# EAGLE schematic zegarek_v1.4 (EAGLE 6.2)
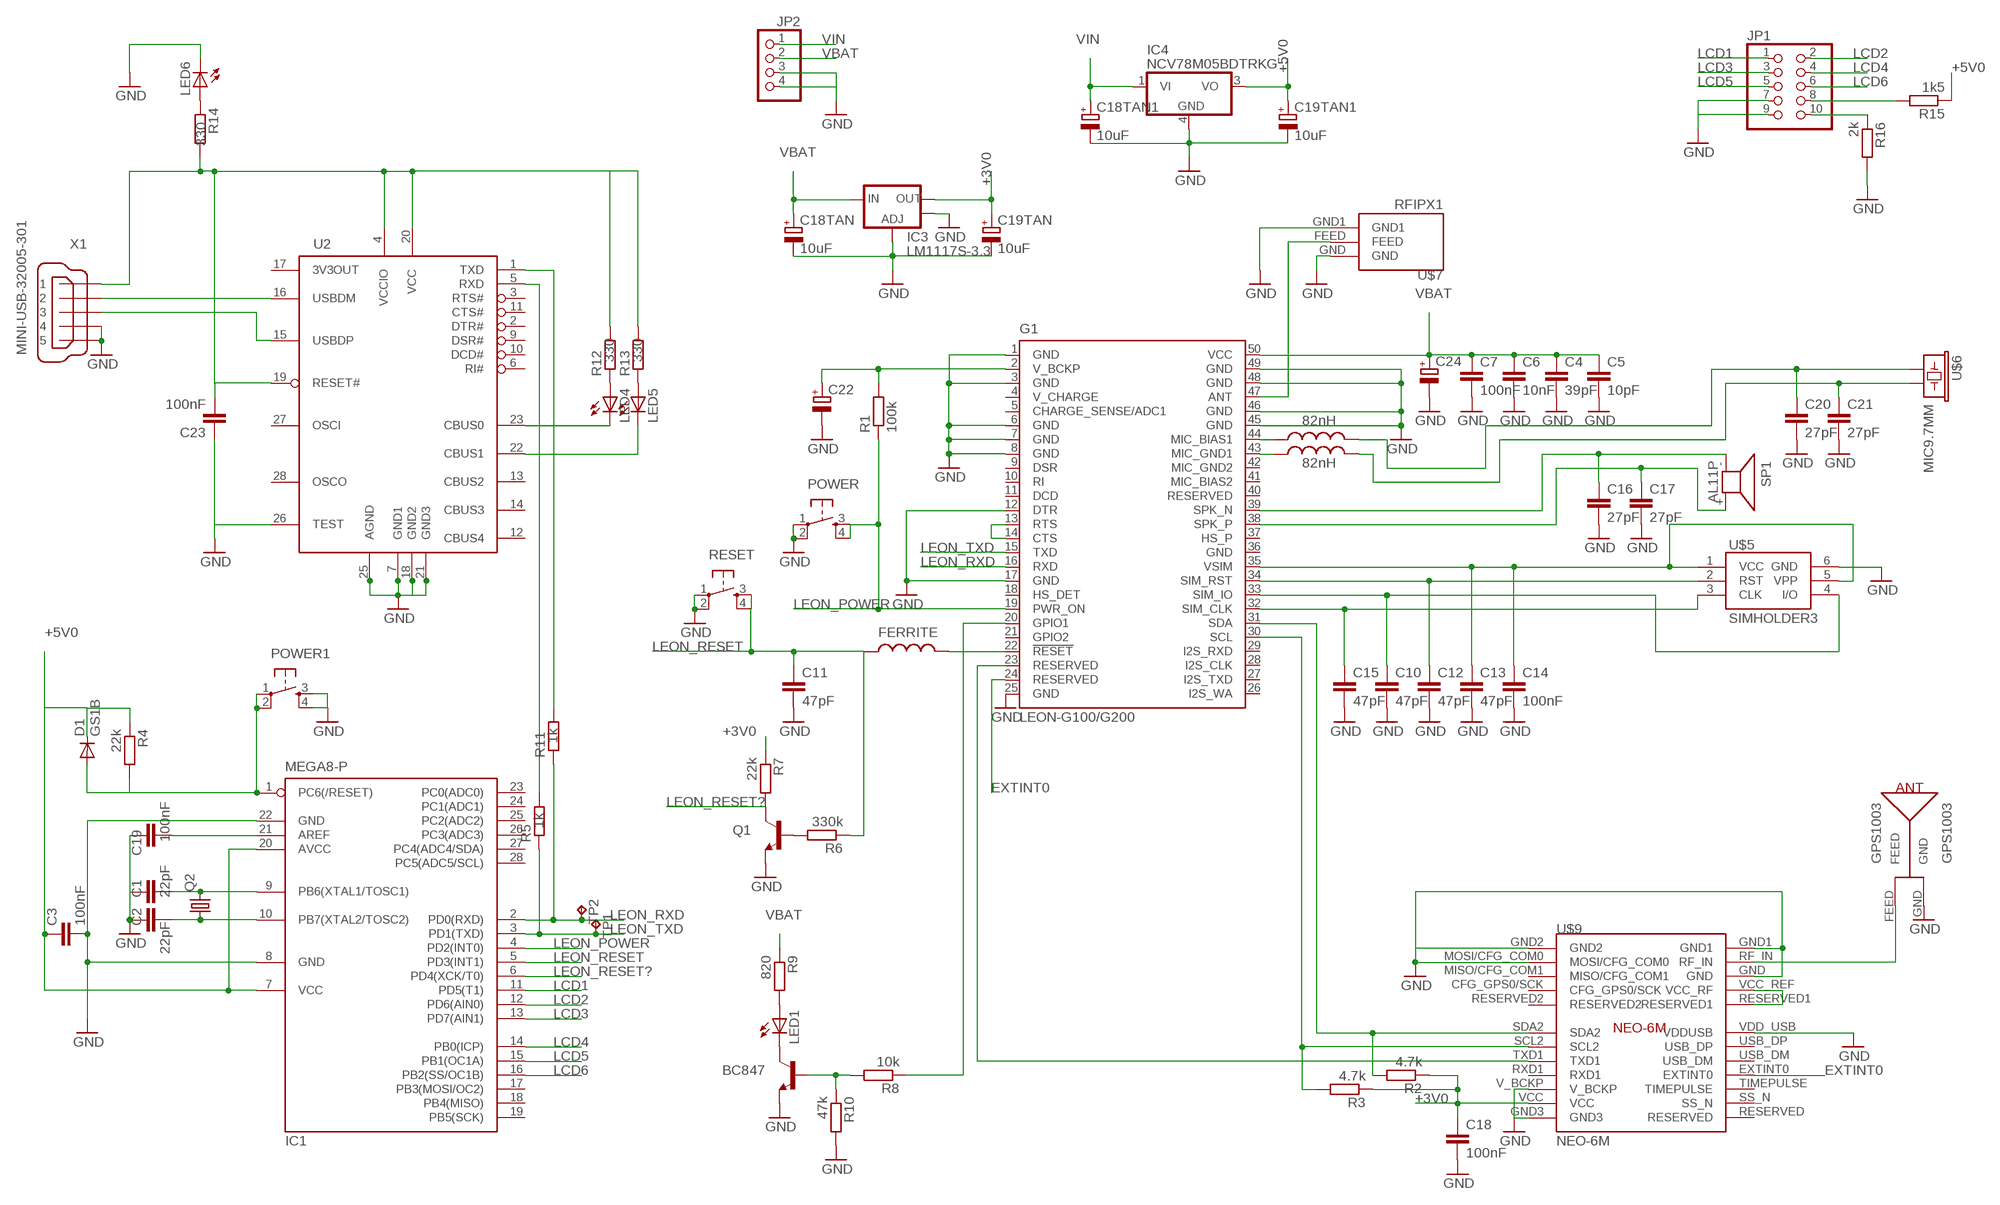
[diagram p0: schematic, sheet 1]

## Parts
BC847  TRANSISTOR_NPNSOT23  [SOT23]
C1  22pF  C-EUC0805  [C0805]
C2  22pF  C-EUC0805  [C0805]
C3  100nF  C-EUC0805  [C0805]
C4  39pF  C-EUC0805  [C0805]
C5  10pF  C-EUC0805  [C0805]
C6  10nF  C-EUC0805  [C0805]
C7  100nF  C-EUC0805  [C0805]
C10  47pF  C-EUC0805  [C0805]
C11  47pF  C-EUC0805  [C0805]
C12  47pF  C-EUC0805  [C0805]
C13  47pF  C-EUC0805  [C0805]
C14  100nF  C-EUC0805  [C0805]
C15  47pF  C-EUC0805  [C0805]
C16  27pF  C-EUC0805  [C0805]
C17  27pF  C-EUC0805  [C0805]
C18  100nF  C-EUC0805  [C0805]
C18TAN  10uF  CPOL-EUSMCA  [SMC_A]
C18TAN1  10uF  CPOL-EUSMCA  [SMC_A]
C19  100nF  C-EUC0805  [C0805]
C19TAN  10uF  CPOL-EUSMCA  [SMC_A]
C19TAN1  10uF  CPOL-EUSMCA  [SMC_A]
C20  27pF  C-EUC0805  [C0805]
C21  27pF  C-EUC0805  [C0805]
C22  CPOL-EUE2-5  [E2-5]
C23  100nF  C-EUC0805  [C0805]
C24  CPOL-EUE2-5  [E2-5]
D1  GS1B  DIODE-DO214AC  [DO214AC]
FERRITE  INDUCTOR0805  [0805]
FERRITE1  82nH  INDUCTOR0805  [0805]
FERRITE2  82nH  INDUCTOR0805  [0805]
G1  LEON-G100/G200  [LEON-G100/G200]
GPS1003  GPS1003  [GPS1003]
IC1  MEGA8-P  [DIL28-3]
IC3  LM1117S-3.3  V_REG_LM1117SOT223  [SOT223]
IC4  NCV78M05BDTRKG  [DPACK_3]
JP1  PINHD-2X5  [2X05]
JP2  PINHD-1X4  [1X04]
LED1  LEDSMT1206  [1206]
LED4  LEDSMT1206  [1206]
LED5  LEDSMT1206  [1206]
LED6  LEDSMT1206  [1206]
POWER  TAC_SWITCHSMD  [TACTILE_SWITCH_SMD]
POWER1  TAC_SWITCHSMD  [TACTILE_SWITCH_SMD]
Q1  TRANSISTOR_NPNSOT23  [SOT23]
Q2  CRYSTALHC49S  [HC49/S]
R1  100k  R-EU_R0805  [R0805]
R2  4.7k  R-EU_R0805  [R0805]
R3  4.7k  R-EU_R0805  [R0805]
R4  22k  R-EU_R0805  [R0805]
R5  1k  R-EU_R0805  [R0805]
R6  330k  R-EU_R0805  [R0805]
R7  22k  R-EU_R0805  [R0805]
R8  10k  R-EU_R0805  [R0805]
R9  820  R-EU_R0805  [R0805]
R10  47k  R-EU_R0805  [R0805]
R11  1k  R-EU_R0805  [R0805]
R12  330  R-EU_R0805  [R0805]
R13  330  R-EU_R0805  [R0805]
R14  330  R-EU_R0805  [R0805]
R15  1k5  R-EU_R0805  [R0805]
R16  2k  R-EU_R0805  [R0805]
RESET  TAC_SWITCHSMD  [TACTILE_SWITCH_SMD]
SP1  AL11P  [AL11P]
TP1  TPTP13R  [TP13R]
TP2  TPTP13R  [TP13R]
U2  FT232RL  [SSOP28DB]
U$5  SIMHOLDER3  [SIMHOLDER3]
U$6  MIC9.7MM  [MIC-9.7MM]
U$7  RFIPX1  [RF-IPX1]
U$9  NEO-6M  [NEO-6M]
X1  MINI-USB-32005-301  [32005-301]

## Nets
+3V0: C18.1 C19TAN.+ IC3.2(OUT) R2.1 R3.1 R7.1 U$9.VCC
+5V0: C3.1 C19TAN1.+ D1.C IC1.7(VCC) IC1.20(AVCC) IC4.3(VO) R4.1 R15.1
EXTINT0: G1.24(RESERVED) U$9.EXTINT0
GND: BC847.2(E) C1.1 C2.1 C3.2 C4.2 C5.2 C6.2 C7.2 C10.2 C11.2 C12.2 C13.2 C14.2 C15.2 C16.2 C17.2 C18.2 C18TAN1.- C18TAN.- C19.2 C19TAN1.- C19TAN.- C20.2 C21.2 C22.- C23.1 C24.- G1.1(GND) G1.3(GND) G1.6(GND) G1.7(GND) G1.8(GND) G1.12(DTR) G1.17(GND) G1.25(GND) G1.45(GND) G1.46(GND) G1.48(GND) G1.49(GND) GPS1003.GND IC1.8(GND) IC1.22(GND) IC3.1(ADJ) IC3.4(OUT) IC4.4(GND) JP1.7 JP1.9 JP2.3 LED6.C POWER1.3 POWER1.4 POWER.1 POWER.2 Q1.2(E) R10.2 R16.2 RESET.1 RESET.2 U2.7(GND1) U2.18(GND2) U2.21(GND3) U2.25(AGND) U2.26(TEST) U$5.6(GND) U$7.GND U$7.GND1 U$9.GND U$9.GND1 U$9.GND2 U$9.GND3 U$9.MOSI/CFG_COM0 U$9.V_BCKP U$9.VDD_USB(VDDUSB) X1.4 X1.5
LCD1: IC1.11(PD5(T1)) JP1.1
LCD2: IC1.12(PD6(AIN0)) JP1.2
LCD3: IC1.13(PD7(AIN1)) JP1.3
LCD4: IC1.14(PB0(ICP)) JP1.4
LCD5: IC1.15(PB1(OC1A)) JP1.5
LCD6: IC1.16(PB2(SS/OC1B)) JP1.6
LEON_POWER: G1.19(PWR_ON) IC1.4(PD2(INT0)) POWER.3 POWER.4 R1.1
LEON_RESET: C11.1 FERRITE.1 IC1.5(PD3(INT1)) R6.1 RESET.3 RESET.4
LEON_RESET?: IC1.6(PD4(XCK/T0)) Q1.3(C) R7.2
LEON_RXD: G1.16(RXD) IC1.2(PD0(RXD)) R11.1 TP2.TP
LEON_TXD: G1.15(TXD) IC1.3(PD1(TXD)) R5.1 TP1.TP
N$1: FERRITE.2 G1.22(!RESET)
N$2: C2.2 IC1.10(PB7(XTAL2/TOSC2)) Q2.1
N$3: C22.+ G1.2(V_BCKP) R1.2
N$4: C13.1 C14.1 G1.35(VSIM) U$5.1(VCC) U$5.5(VPP)
N$5: C15.1 G1.32(SIM_CLK) U$5.3(CLK)
N$6: C12.1 G1.34(SIM_RST) U$5.2(RST)
N$7: C16.1 G1.39(SPK_N) SP1.-
N$8: C10.1 G1.33(SIM_IO) U$5.4(I/O)
N$9: C17.1 G1.38(SPK_P) SP1.+
N$10: G1.13(RTS) G1.14(CTS)
N$11: FERRITE1.1 G1.44(MIC_BIAS1)
N$12: FERRITE2.1 G1.43(MIC_GND1)
N$13: C20.1 FERRITE1.2 U$6.1
N$14: C21.1 FERRITE2.2 U$6.2
N$15: Q1.1(B) R6.2
N$16: BC847.1(B) R8.2 R10.1
N$17: LED1.A R9.2
N$18: BC847.3(C) LED1.C
N$19: G1.20(GPIO1) R8.1
N$20: G1.47(ANT) U$7.FEED
N$23: GPS1003.FEED U$9.RF_IN
N$24: G1.31(SDA) R2.2 U$9.SDA2
N$25: U$9.RESERVED1 U$9.VCC_REF(VCC_RF)
N$26: G1.30(SCL) R3.2 U$9.SCL2
N$27: G1.23(RESERVED) U$9.TXD1
N$28: C1.2 IC1.9(PB6(XTAL1/TOSC1)) Q2.2
N$29: D1.A IC1.1(PC6(/RESET)) POWER1.1 POWER1.2 R4.2
N$30: C19.1 IC1.21(AREF)
N$31: LED4.A R12.1
N$32: LED5.A R13.1
N$33: LED4.C U2.23(CBUS0)
N$34: LED5.C U2.22(CBUS1)
N$35: R11.2 U2.1(TXD)
N$36: R5.2 U2.5(RXD)
N$37: JP1.10 R16.1
N$38: JP1.8 R15.2
N$40: JP2.4
N$47: C23.2 R12.2 R13.2 R14.2 U2.4(VCCIO) U2.19(RESET#) U2.20(VCC) X1.1
N$48: U2.16(USBDM) X1.2
N$49: U2.15(USBDP) X1.3
N$51: LED6.A R14.1
VBAT: C4.1 C5.1 C6.1 C7.1 C18TAN.+ C24.+ G1.50(VCC) IC3.3(IN) JP2.2 R9.1
VIN: C18TAN1.+ IC4.1(VI) JP2.1
Unconnected: G1.4(V_CHARGE) G1.5(CHARGE_SENSE/ADC1) G1.9(DSR) G1.10(RI) G1.11(DCD) G1.18(HS_DET) G1.21(GPIO2) G1.26(I2S_WA) G1.27(I2S_TXD) G1.28(I2S_CLK) G1.29(I2S_RXD) G1.37(HS_P) G1.40(RESERVED) G1.41(MIC_BIAS2) G1.42(MIC_GND2) IC1.17(PB3(MOSI/OC2)) IC1.18(PB4(MISO)) IC1.19(PB5(SCK)) IC1.23(PC0(ADC0)) IC1.24(PC1(ADC1)) IC1.25(PC2(ADC2)) IC1.26(PC3(ADC3)) IC1.27(PC4(ADC4/SDA)) IC1.28(PC5(ADC5/SCL)) U2.2(DTR#) U2.3(RTS#) U2.6(RI#) U2.9(DSR#) U2.10(DCD#) U2.11(CTS#) U2.12(CBUS4) U2.13(CBUS2) U2.14(CBUS3) U2.17(3V3OUT) U2.27(OSCI) U2.28(OSCO) U$9.CFG_GPS0/SCK U$9.MISO/CFG_COM1 U$9.RESERVED U$9.RESERVED2 U$9.RXD1 U$9.SS_N U$9.TIMEPULSE U$9.USB_DM U$9.USB_DP

## Power pins joined to a net without a drawn wire
GND: G1.36(GND)

## Library data of the parts
BC847 Q1 = SparkFun:TRANSISTOR_NPN: Transistor NPN BJT configuration in SOT23 package. MMBT2222 is the common NPN we use. Double check BCE configuration again layout.
C1-C7 C10-C21 C23 = rcl:C-EU: CAPACITOR, European symbol
C18TAN C18TAN1 C19TAN C19TAN1 C22 C24 = rcl:CPOL-EU: POLARIZED CAPACITOR, European symbol
D1 = diode:DIODE-: DIODE
FERRITE FERRITE1 FERRITE2 = SparkFun:INDUCTOR: Inductors Basic Inductor/Choke - 0603 and 1206. Footprints are not proven and vary greatly between part numbers.
G1 = u-blox-1:LEON-G100/G200: LEON-G100/G200 Quad Band GSM/GPRS Voice and Data Modules Source: http://www.u-blox.com; OC_FARNELL: unknown; OC_NEWARK: unknown
GPS1003 = u-blox_NEO-6M:GPS1003
IC1 = atmel:MEGA8-P: MICROCONTROLLER 8 Kbytes FLASH, 1 kbytes SRAM, 512 bytes EEPROM, USART, 4-channel 10 bit ADC, 2-channel 8 bit ADC Pin compatible with Atmega48, ATMega88, ATMega168 Source: avr.lbr; OC_FARNELL: unknown; OC_NEWARK: unknown
IC3 = SparkFun:V_REG_LM1117: Voltage Regulator LM1117 Standard adjustable voltage regulator but in SMD form. Spark Fun Electronics SKU : COM-00595
IC4 = linear:NCV78M: 500 mA Positive Voltage Regulators Source: Data sheet <http://www.onsemi.com/pub_link/Collateral/MC78M00-D.PDF>
JP1 = pinhead:PINHD-2X5: PIN HEADER
JP2 = pinhead:PINHD-1X4: PIN HEADER
LED1 LED4-LED6 = led:LED: LED OSRAM: - CHIPLED LG R971, LG N971, LY N971, LG Q971, LY Q971, LO R971, LY R971 LH N974, LH R974 LS Q976, LO Q976, LY Q976 LO Q996 - Hyper CHIPLED LW Q18S LB Q993, LB Q99A, LB R99A - SideLED LS A670, LO A670, LY A670, LG A670, LP A670 LB A673, LV A673, LT A673, LW A673 LH A674 LY A675 LS A676, LA A676, LO A676, LY A676, LW A676 LS A679, LY A679, LG A679 - Hyper Micro SIDELED® LS Y876, LA Y876, LO Y876, LY Y876 LT Y87S - SmartLED LW L88C, LW L88S LB L89C, LB L89S, LG L890 LS L89K, LO L89K, LY L89K LS L896, LA L896, LO L896, LY L896 - TOPLED LS T670, LO T670, LY T670, LG T670, LP T670 LSG T670, LSP T670, LSY T670, LOP T670, LYG T670 LG T671, LOG T671, LSG T671 LB T673, LV T673, LT T673, LW T673 LH T674 LS T676, LA T676, LO T676, LY T676, LB T676, LH T676, LSB T676, LW T676 LB T67C, LV T67C, LT T67C, LS T67K, LO T67K, LY T67K, LW E67C LS E67B, LA E67B, LO E67B, LY E67B, LB E67C, LV E67C, LT E67C LW T67C LS T679, LY T679, LG T679 LS T770, LO T770, LY T770, LG T770, LP T770 LB T773, LV T773, LT T773, LW T773 LH T774 LS E675, LA E675, LY E675, LS T675 LS T776, LA T776, LO T776, LY T776, LB T776 LHGB T686 LT T68C, LB T68C - Hyper Mini TOPLED® LB M676 - Mini TOPLED Santana® LG M470 LS M47K, LO M47K, LY M47K Source: http://www.osram.convergy.de LUXEON: - LUMILED® LXK2-PW12-R00, LXK2-PW12-S00, LXK2-PW14-U00, LXK2-PW14-V00 LXK2-PM12-R00, LXK2-PM12-S00, LXK2-PM14-U00 LXK2-PE12-Q00, LXK2-PE12-R00, LXK2-PE12-S00, LXK2-PE14-T00, LXK2-PE14-U00 LXK2-PB12-K00, LXK2-PB12-L00, LXK2-PB12-M00, LXK2-PB14-N00, LXK2-PB14-P00, LXK2-PB14-Q00 LXK2-PR12-L00, LXK2-PR12-M00, LXK2-PR14-Q00, LXK2-PR14-R00 LXK2-PD12-Q00, LXK2-PD12-R00, LXK2-PD12-S00 LXK2-PH12-R00, LXK2-PH12-S00 LXK2-PL12-P00, LXK2-PL12-Q00, LXK2-PL12-R00 Source: www.luxeon.com KINGBRIGHT: KA-3528ASYC Source: www.kingbright.com
POWER POWER1 RESET = SparkFun:TAC_SWITCH: Momentary Switch Button commonly used for reset or general input. Spark Fun Electronics SKU : COM-00097
Q2 = crystal:CRYSTAL: CRYSTAL; OC_FARNELL: 1667008; OC_NEWARK: unknown
R1-R16 = rcl:R-EU_: RESISTOR, European symbol
SP1 = buzzer:AL11P: SPEAKER Source: Buerklin; OC_FARNELL: unknown; OC_NEWARK: unknown
TP1 TP2 = testpad:TP: Test pad
U2 = ftdichip-5:FT232RL: USB UART 4th Generation USB UART (USB <-> Serial) Controller
U$5 = SparkFun:SIMHOLDER3
U$6 = SparkFun:MIC: Microphone Omni-directional electret microphone. 9.7mm standard diameter.
U$7 = RFIPX:RFIPX1
U$9 = u-blox_NEO-6M:NEO-6M
X1 = con-cypressindustries:MINI-USB-: MINI USB-B Conector Source: www.cypressindustries.com; OC_FARNELL: unknown; OC_NEWARK: unknown

## Net classes
0 default: width 0.203 mm